# Altium schematic sheet [05] - Power.SchDoc: =ProjectName
size A4; CheckedBy: Ven; Author: Ven; CompanyName: HUST; Revision: V.1.0
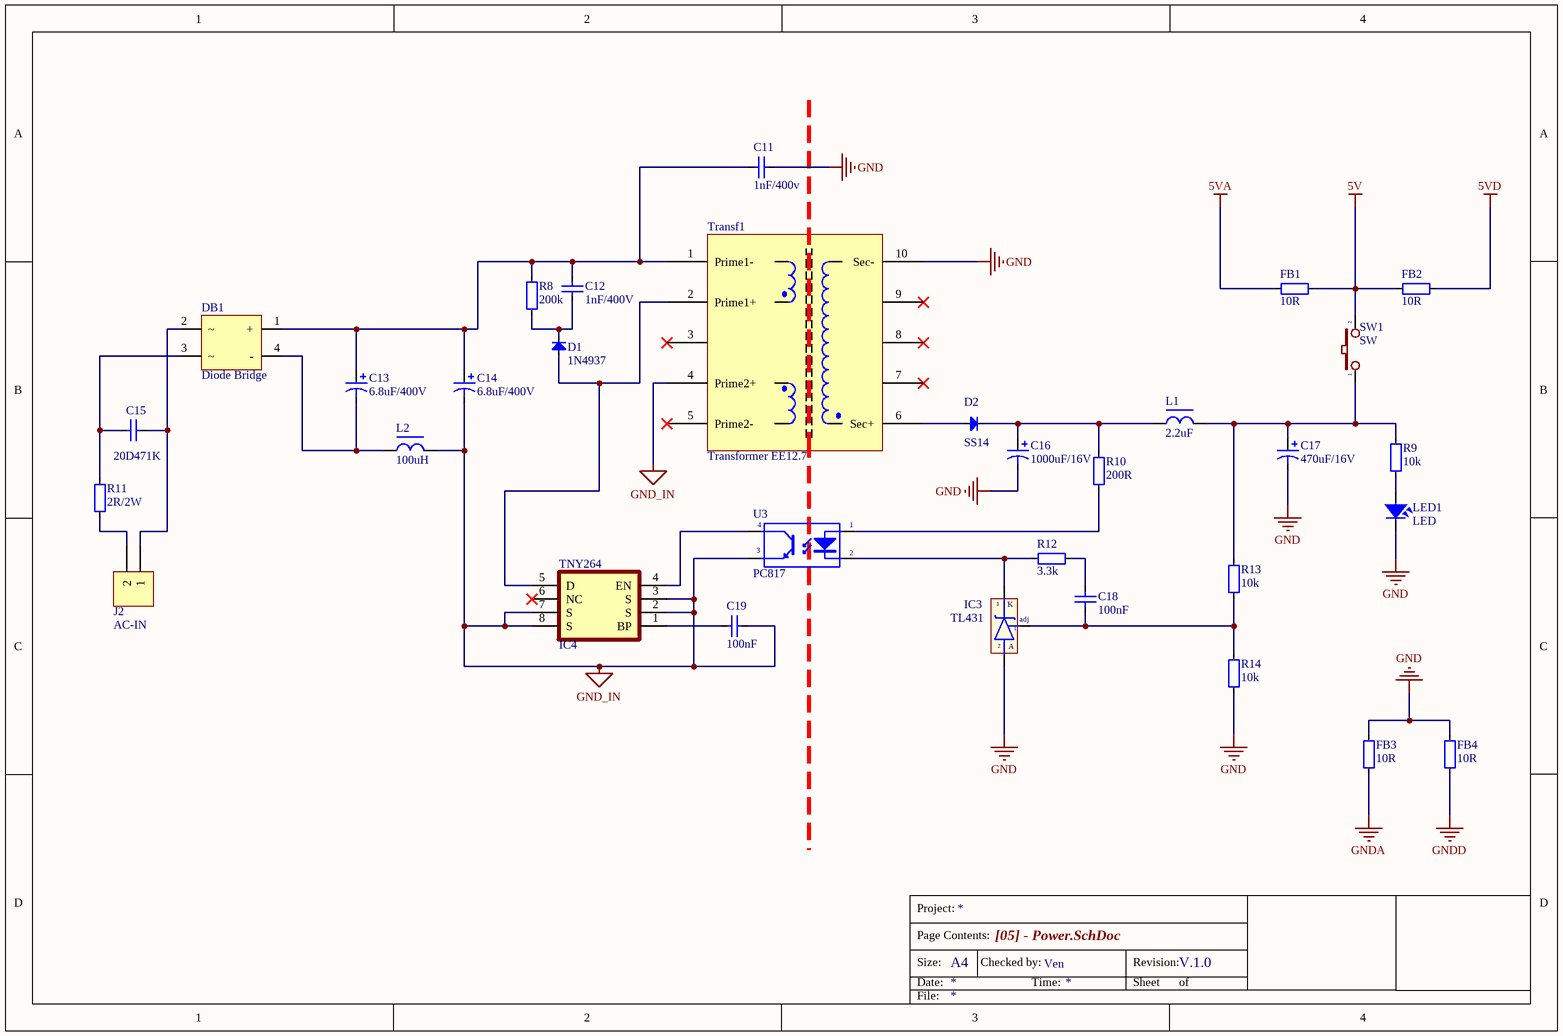
[diagram p0: [05] - Power.SchDoc]

## Parts
C11  1nF/400v  [103/2KV]
C12  1nF/400V  [103/2KV]
C13  6.8uF/400V  [C8mm]
C14  6.8uF/400V  [C8mm]
C15  20D471K  [103/2KV]
C16  1000uF/16V  [C8mm]
C17  470uF/16V  [C8mm]
C18  100nF  [CAP_0805]
C19  100nF  [CAP_0805]
D1  1N4937  [DIO-1AN]
D2  SS14  [DO-214AC(SMA)]
DB1  Diode Bridge  [DB207S]
FB1  10R  [RES-SMD-0805]
FB2  10R  [RES-SMD-0805]
FB3  10R  [RES-SMD-0805]
FB4  10R  [RES-SMD-0805]
IC3  TL431  [qto-92]
IC4  TNY264  [DIP8]
J2  AC-IN  [KF2-5.08]
L1  2.2uF  [L-SMD-M-7.3x4.5]
L2  100uH  [L-DIP-M-9.5x6]
LED1  LED  [LED-0805-Red]
R8  200k  [RES-1/4WD]
R9  10k  [RES-SMD-0805]
R10  200R  [RES-SMD-0805]
R11  2R/2W  [RES-1WD]
R12  3.3k  [RES-SMD-0805]
R13  10k  [RES-SMD-0805]
R14  10k  [RES-SMD-0805]
SW1  SW  [SW2]
Transf1  Transformer EE12.7  [Transformer EE12.7]
U3  PC817  [DIP4/W0.3]

## Nets
5V: FB1.2 FB2.1 SW1.2
5VA: FB1.1
5VD: FB2.2
GND: C11.1 C16.2 C17.2 FB3.2 FB4.2 IC3.2(A) LED1.2 R14.2 Transf1.10(Sec-)
GND_IN: C14.2 C19.1 IC4.2(S) IC4.3(S) IC4.7(S) IC4.8(S) L2.2 Transf1.4(Prime2+) U3.3(E)
GNDA: FB3.1
GNDD: FB4.1
NetC11_2: C11.2 C12.1 C13.1 C14.1 DB1.1(+) R8.2 Transf1.1(Prime1-)
NetC12_2: C12.2 D1.2(K) R8.1
NetC13_2: C13.2 DB1.4(-) L2.1
NetC15_1: C15.1 DB1.2 J2.1
NetC15_2: C15.2 DB1.3 R11.1
NetC16_1: C16.1 D2.2(K) L1.1 R10.1
NetC17_1: C17.1 L1.2 R9.1 R13.1 SW1.1
NetC18_1: C18.1 IC3.1(adj) R13.2 R14.1
NetC18_2: C18.2 R12.2
NetC19_2: C19.2 IC4.1(BP)
NetD1_1: D1.1(A) IC4.5(D) Transf1.2(Prime1+)
NetD2_1: D2.1(A) Transf1.6(Sec+)
NetIC3_3: IC3.3(K) R12.1 U3.2(K)
NetIC4_4: IC4.4(EN) U3.4(C)
NetJ2_2: J2.2 R11.2
NetLED1_1: LED1.1 R9.2
NetR10_2: R10.2 U3.1(A)

Not connected (* = marked no-connect by the designer): IC4 6(NC)*; Transf1 3* 5(Prime2-)* 7* 8* 9*

## Notes on the sheet
- Project:
- Page Contents:
- Size:
- Date:
- A4
- Checked by:
- Time:
- Revision:
- Sheet
- of
- File:

## Library data of the parts
C11 C12 = Cap2KV: CAP CERAMIC; Published: 8-Jun-2000; LatestRevisionDate: 17-Jul-2002; LatestRevisionNote: Re-released for DXP Platform.; PackageReference: RAD-0.3; Publisher: Altium Limited
C13 C14 C16 C17 = Cap Pol: Polarized Capacitor (Axial); Published: 8-Jun-2000; LatestRevisionDate: 17-Jul-2002; LatestRevisionNote: Re-released for DXP Platform.; PackageReference: POLAR0.8; Publisher: Altium Limited
C15 = Cap2KV: Varistor; Published: 8-Jun-2000; LatestRevisionDate: 17-Jul-2002; LatestRevisionNote: Re-released for DXP Platform.; PackageReference: RAD-0.3; Publisher: Altium Limited
C18 C19 = CapSMD: Capacitor; Value: 33p; Published: 8-Jun-2000; LatestRevisionDate: 17-Jul-2002; LatestRevisionNote: Re-released for DXP Platform.; PackageReference: RAD-0.3; Publisher: Altium Limited
D1 = Diode SMD: Diode Schottky / 1N4937; Code - JEDEC: DO-214-AB; Value: 1N5007; Published: 8-Jun-2000; Revision: July-2002: Re-released for DXP Platform.; Publisher: Altium Limited
D2 = Diode SMD: Diode Schottky / 1N5819; Code - JEDEC: DO-214-AB; Value: 1N5007; Published: 8-Jun-2000; Revision: July-2002: Re-released for DXP Platform.; Publisher: Altium Limited
DB1 = Diode Bridge Flate
FB1-FB4 = Resistor - SMD: Ferrit Bead; Manufacturer: Generic Components; Class: Passive; Published: 08/06/2000; Publisher: Altium Hobart Technology Centre
IC3 = TL431: Programmable Shunt Regulator; Value: TL431
IC4 = TNY264: Enhanced, Energy Efficient, Low Power Off-line Switcher
J2 = KF2: Manufacturer: Würth Elektronik eiSos GmbH; partNo: 691103110002; ComponentLink1 Description: Manufacturer; ComponentLink2 Description: Datasheet; NoPins: 2; Created Date: 29 October 2013; ComponentLink1URL: http://www.we-online.com; ComponentLink2URL: http://katalog.we-online.de/em/datasheet/6911031100xx.pdf; Created by: Karrer Zheng
L1 L2 = L-DIP-1: Inductor; Value: 150 mH
LED1 = LED: LED Single colour Green and Red; Value: LED 3 ly Single Colour
R8-R14 = Resistor - SMD: Resistor; Manufacturer: Generic Components; Class: Passive; Published: 08/06/2000; Publisher: Altium Hobart Technology Centre
SW1 = SW2: Switch button 2 pin; Value: SW chip 2 pin
Transf1 = Tranformer EE16
U3 = PC817: Single Opto; Value: PC817